# Altium schematic sheet ADCs.SCHDOC
size B
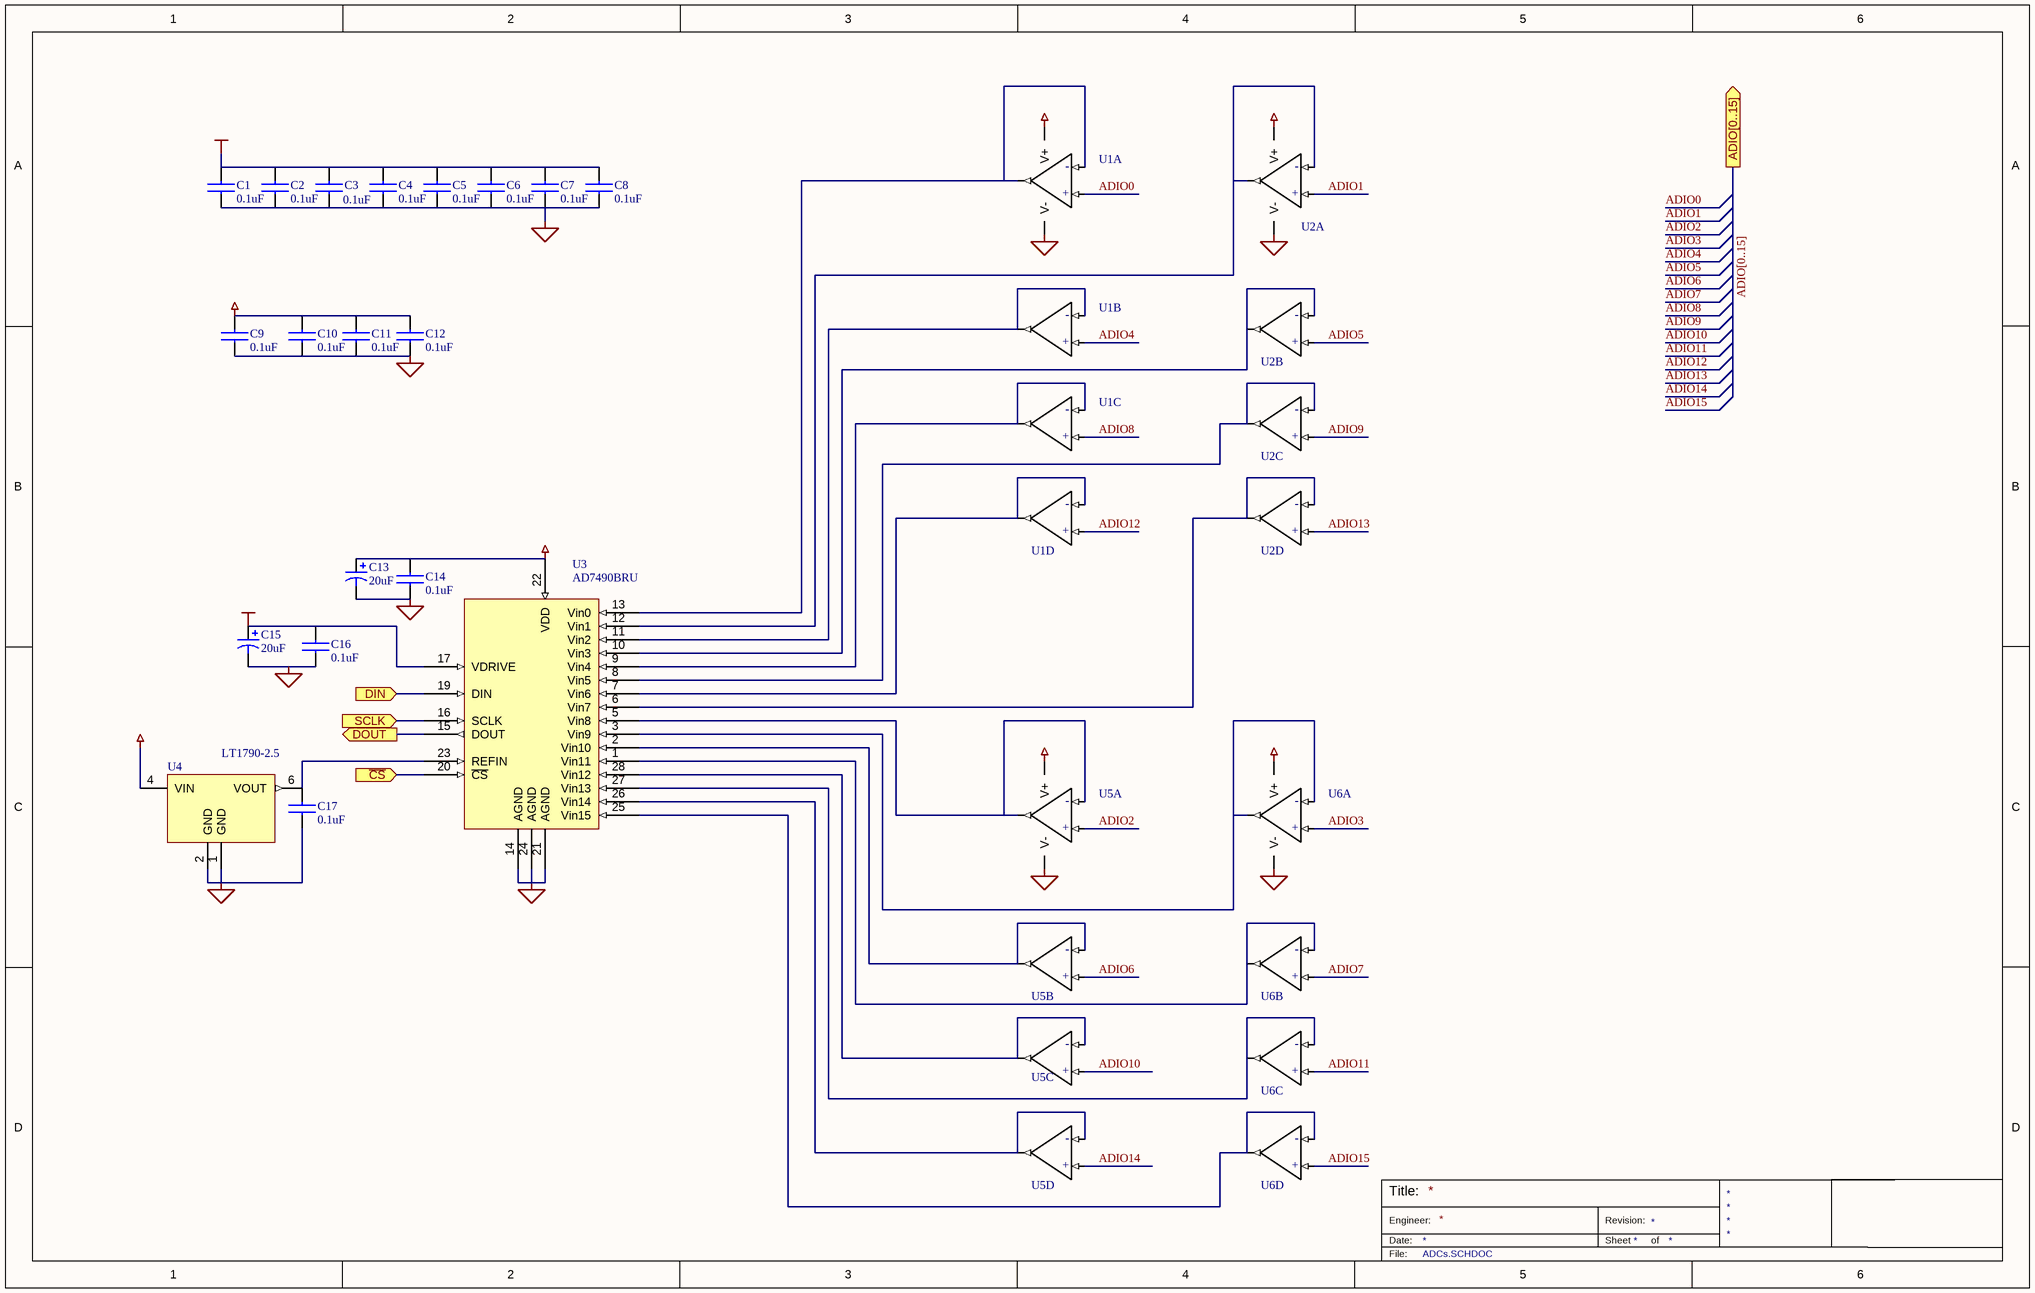
[diagram p0: ADCs.SCHDOC]

## Parts
C1  value 0.1uF  [0603]  (hidden comment: CAPACITOR)
C2  value 0.1uF  [0603]  (hidden comment: CAPACITOR)
C3  value 0.1uF  [0603]  (hidden comment: CAPACITOR)
C4  value 0.1uF  [0603]  (hidden comment: CAPACITOR)
C5  value 0.1uF  [0603]  (hidden comment: CAPACITOR)
C6  value 0.1uF  [0603]  (hidden comment: CAPACITOR)
C7  value 0.1uF  [0603]  (hidden comment: CAPACITOR)
C8  value 0.1uF  [0603]  (hidden comment: CAPACITOR)
C9  value 0.1uF  [0603]  (hidden comment: CAPACITOR)
C10  value 0.1uF  [0603]  (hidden comment: CAPACITOR)
C11  value 0.1uF  [0603]  (hidden comment: CAPACITOR)
C12  value 0.1uF  [0603]  (hidden comment: CAPACITOR)
C13  value 20uF  [C]  (hidden comment: Cap Pol1)
C14  value 0.1uF  [0603]  (hidden comment: CAPACITOR)
C15  value 20uF  [C]  (hidden comment: Cap Pol1)
C16  value 0.1uF  [0603]  (hidden comment: CAPACITOR)
C17  value 0.1uF  [0603]  (hidden comment: CAPACITOR)
U1  OP496  [SO-G14]  (value not drawn)  (parts A,B,C,D of 4)
U2  OP496  [SO-G14]  (value not drawn)  (parts A,B,C,D of 4)
U3  AD7490BRU  [SSO-G28/X.45]
U4  LT1790-2.5  [LTI SOT-23 ThinSOT]
U5  OP496  [SO-G14]  (value not drawn)  (parts A,B,C,D of 4)
U6  OP496  [SO-G14]  (value not drawn)  (parts A,B,C,D of 4)

## Ports
ADIO[0..15] (out), DIN (in), DOUT (out), SCLK (in), ~{CS} (in)

## Nets
+5VCC: C1.2 C2.2 C3.2 C4.2 C5.2 C6.2 C7.2 C8.2
AVDD: C9.2 C10.2 C11.2 C12.2 C13.1 C14.2 U1.4(V+) U2.4(V+) U3.22(VDD) U4.4(VIN) U5.4(V+) U6.4(V+)
GND: C1.1 C2.1 C3.1 C4.1 C5.1 C6.1 C7.1 C8.1 C9.1 C10.1 C11.1 C12.1 C13.2 C14.1 C15.2 C16.1 C17.2 U1.11(V-) U2.11(V-) U3.14(AGND) U3.21(AGND) U3.24(AGND) U4.1(GND) U4.2(GND) U5.11(V-) U6.11(V-)
VCC: C15.1 C16.2 U3.17(VDRIVE)
ADIO0: U1.3(+INA)
ADIO1: U2.3(+INA)
ADIO2: U5.3(+INA)
ADIO3: U6.3(+INA)
ADIO4: U1.5(+INB)
ADIO5: U2.5(+INB)
ADIO6: U5.5(+INB)
ADIO7: U6.5(+INB)
ADIO8: U1.10(+INC)
ADIO9: U2.10(+INC)
ADIO10: U5.10(+INC)
ADIO11: U6.10(+INC)
ADIO12: U1.12(+IND)
ADIO13: U2.12(+IND)
ADIO14: U5.12(+IND)
ADIO15: U6.12(+IND)
~{CS}: U3.20(~{CS}) ; port ~{CS}
DIN: U3.19(DIN) ; port DIN
DOUT: U3.15(DOUT) ; port DOUT
SCLK: U3.16(SCLK) ; port SCLK
NetC17_1: C17.1 U3.23(REFIN) U4.6(VOUT)
NetU1_1: U1.1(OUTA) U1.2(-INA) U3.13(Vin0)
NetU1_6: U1.6(-INB) U1.7(OUTB) U3.11(Vin2)
NetU1_8: U1.8(OUTC) U1.9(-INC) U3.9(Vin4)
NetU1_13: U1.13(-IND) U1.14(OUTD) U3.7(Vin6)
NetU2_1: U2.1(OUTA) U2.2(-INA) U3.12(Vin1)
NetU2_6: U2.6(-INB) U2.7(OUTB) U3.10(Vin3)
NetU2_8: U2.8(OUTC) U2.9(-INC) U3.8(Vin5)
NetU2_13: U2.13(-IND) U2.14(OUTD) U3.6(Vin7)
NetU3_1: U3.1(Vin11) U6.6(-INB) U6.7(OUTB)
NetU3_2: U3.2(Vin10) U5.6(-INB) U5.7(OUTB)
NetU3_3: U3.3(Vin9) U6.1(OUTA) U6.2(-INA)
NetU3_5: U3.5(Vin8) U5.1(OUTA) U5.2(-INA)
NetU3_25: U3.25(Vin15) U6.13(-IND) U6.14(OUTD)
NetU3_26: U3.26(Vin14) U5.13(-IND) U5.14(OUTD)
NetU3_27: U3.27(Vin13) U6.8(OUTC) U6.9(-INC)
NetU3_28: U3.28(Vin12) U5.8(OUTC) U5.9(-INC)

## Buses and harness runs
bus ADIO[0..15] = port ADIO[0..15]

## Notes on the sheet
- Title:
- Engineer:
- Date:
- Revision:
- Sheet
- of
- File:
- (in symbol OP496, part A) -; +
- (in symbol OP496, part B) -; +
- (in symbol OP496, part C) -; +
- (in symbol OP496, part D) -; +

## Library data of the parts
C1-C12 C14 C16 C17 = CAPACITOR: Standard Capacitor
C13 C15 = Cap Pol1: Polarized Capacitor (Radial); Published: 8-Jun-2000; LatestRevisionDate: 17-Jul-2002; LatestRevisionNote: Re-released for DXP Platform.; Publisher: Altium Limited
U1 U2 U5 U6 = OP496: AD quad RRIO OA
U3 = AD7490BRU: AD 16-chan 12-bit ADC
U4 = LT1790: Micropower SOT-23 Low Dropout Reference Family